# Altium schematic sheet Indicators.SchDoc
size 420 x 297 mm; SheetNumber: 4; SheetTotal: 6
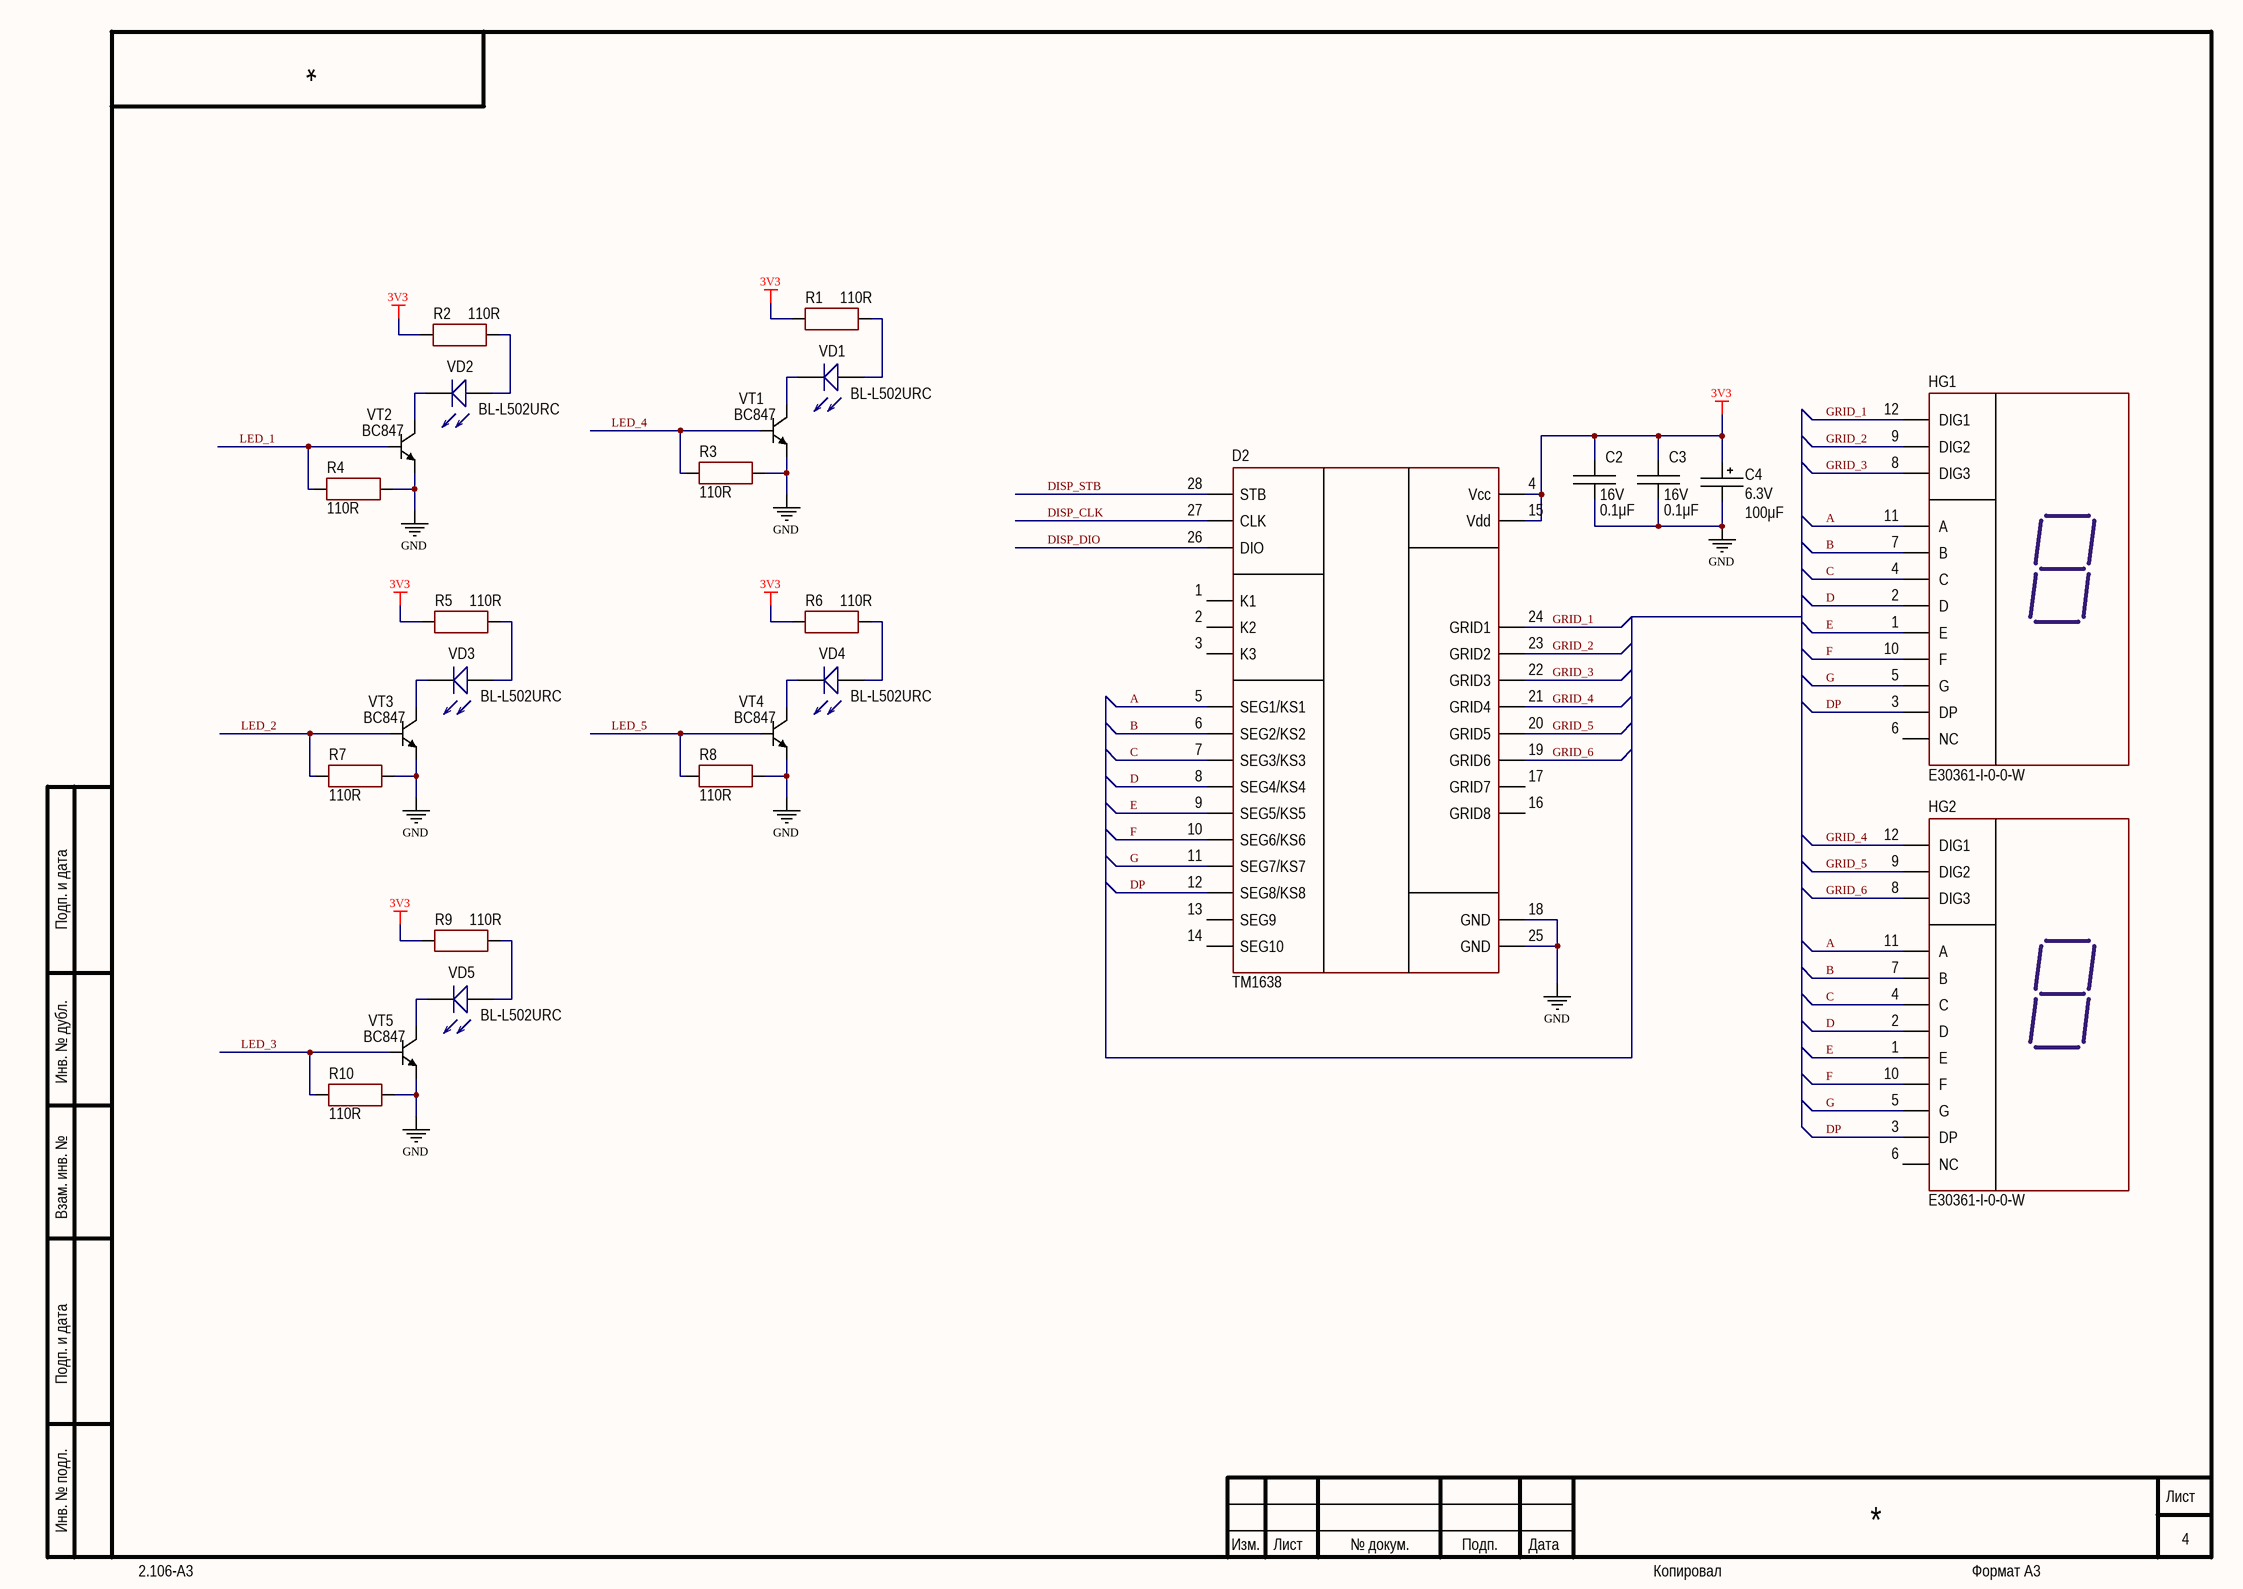
[diagram p0: Indicators.SchDoc]

## Parts
C2  value 0.1μF  Voltage: 16V  [CAP: 0805]
C3  value 0.1μF  Voltage: 16V  [CAP: 0805]
C4  value 100μF  Voltage: 6.3V  [CAP: TANTAL-C]
D2  (no value)  [28-SOP]
HG1  PartNumber: E30361-I-0-0-W  [DISP: CL3631BH - GREEN (0,36")]
HG2  PartNumber: E30361-I-0-0-W  [DISP: CL3631BH - GREEN (0,36")]
R1  value 110R  [RES: 1206]
R2  value 110R  [RES: 1206]
R3  value 110R  [RES: 1206]
R4  value 110R  [RES: 1206]
R5  value 110R  [RES: 1206]
R6  value 110R  [RES: 1206]
R7  value 110R  [RES: 1206]
R8  value 110R  [RES: 1206]
R9  value 110R  [RES: 1206]
R10  value 110R  [RES: 1206]
VD1  LED  [LED 5mm RED]  (value not drawn)
VD2  LED  [LED 5mm RED]  (value not drawn)
VD3  LED  [LED 5mm RED]  (value not drawn)
VD4  LED  [LED 5mm RED]  (value not drawn)
VD5  LED  [LED 5mm RED]  (value not drawn)
VT1  PartNumber: BC847  [SOT23]
VT2  PartNumber: BC847  [SOT23]
VT3  PartNumber: BC847  [SOT23]
VT4  PartNumber: BC847  [SOT23]
VT5  PartNumber: BC847  [SOT23]

## Nets
3V3: C2.2 C3.2 C4.1 D2.4(Vcc) D2.15(Vdd) R1.2 R2.2 R5.2 R6.2 R9.2
GND: C2.1 C3.1 C4.2 D2.18(GND) D2.25(GND) R3.1 R4.1 R7.1 R8.1 R10.1 VT1.2(E) VT2.2(E) VT3.2(E) VT4.2(E) VT5.2(E)
A: D2.5(SEG1/KS1) HG1.11(A) HG2.11(A)
B: D2.6(SEG2/KS2) HG1.7(B) HG2.7(B)
C: D2.7(SEG3/KS3) HG1.4(C) HG2.4(C)
D: D2.8(SEG4/KS4) HG1.2(D) HG2.2(D)
DISP_CLK: D2.27(CLK)
DISP_DIO: D2.26(DIO)
DISP_STB: D2.28(STB)
DP: D2.12(SEG8/KS8) HG1.3(DP) HG2.3(DP)
E: D2.9(SEG5/KS5) HG1.1(E) HG2.1(E)
F: D2.10(SEG6/KS6) HG1.10(F) HG2.10(F)
G: D2.11(SEG7/KS7) HG1.5(G) HG2.5(G)
GRID_1: D2.24(GRID1) HG1.12(DIG1)
GRID_2: D2.23(GRID2) HG1.9(DIG2)
GRID_3: D2.22(GRID3) HG1.8(DIG3)
GRID_4: D2.21(GRID4) HG2.12(DIG1)
GRID_5: D2.20(GRID5) HG2.9(DIG2)
GRID_6: D2.19(GRID6) HG2.8(DIG3)
LED_1: R4.2 VT2.1(B)
LED_2: R7.2 VT3.1(B)
LED_3: R10.2 VT5.1(B)
LED_4: R3.2 VT1.1(B)
LED_5: R8.2 VT4.1(B)
NetR1_1: R1.1 VD1.2
NetR2_1: R2.1 VD2.2
NetR5_1: R5.1 VD3.2
NetR6_1: R6.1 VD4.2
NetR9_1: R9.1 VD5.2
NetVD1_1: VD1.1 VT1.3(C)
NetVD2_1: VD2.1 VT2.3(C)
NetVD3_1: VD3.1 VT3.3(C)
NetVD4_1: VD4.1 VT4.3(C)
NetVD5_1: VD5.1 VT5.3(C)

Not connected (* = marked no-connect by the designer): D2 1(K1) 2(K2) 3(K3) 13(SEG9) 14(SEG10) 16(GRID8) 17(GRID7); HG1 6(NC); HG2 6(NC)

## Notes on the sheet
- Подп. и дата
- Инв. № дубл.
- Взам. инв. №
- Инв. № подл.
- Изм.
- Лист
- № докум.
- Подп.
- Дата
- 2.106-A3
- Копировал
- Формат А3

## Library data of the parts
C2 C3 = Ceramic_0805: Manufacturer: Yageo; PartNumber: CC0805KRX7R7BB104; ValueManufacturerPartNumber: Ceramic capacitor, 0.1μF, X7R, ±10%, 16V, 0805, -55...+125°C; TypeCapacitor: Ceramic capacitor; Tolerance: ±10%; TypeDielectric: X7R; Package: 0805; HelpURL: https://www.digikey.com/product-detail/en/yageo/CC0805KRX7R7BB104/311-1142-1-ND/303052; Temperature: -55...+125°C
C4 = Tantal_C: Manufacturer: AVX; PartNumber: F931E226MCC; ValueManufacturerPartNumber: Tantalum capacitor, 100μF, 6.3V, ±10%, 1.1Ohm, case C (6032), -55...+125°C; Impedance: 1.1Ohm; Tolerance: ±10%; TypeDielectric: X7R; TypeCapacitor: Tantalum capacitor; Package: case C (6032); HelpURL: https://www.digikey.com/product-detail/en/avx-corporation/F931E226MCC/478-8314-1-ND/4006045; Temperature: -55...+125°C
D2 = TM1638: 7-seg LED Driver; Manufacturer: TM(Shenzhen Titan Micro Elec); ValueManufacturerPartNumber: LED Display driver, 480 Mb/s, ULPI, USB, 3...3.6V, -40...+85°C, SOP-28; Supply: 3...3.6V; DataRate: 480 Mb/s; Protocol: ULPI, USB; HelpURL: https://www.lcsc.com/product-detail/span-style-background-color-ff0-LED-span-Display-Drivers_TM-Shenzhen-Titan-Micro-Elec-TM1638_C19187.html; Package: SOP-28; ComponentType: LED Display driver; Temperature: -40...+85°C; PartNumber: TM1638
HG1 HG2 = E30361: 7 segment LED indicator 3 dig; Package: 14х22,5; ComponentType: 7Seg LED; ValueManufacturerPartNumber: =ComponentType+', '+TypeStandart+', '+Core+', '+TypeInterface+', '+Temperature+', '+Package; Temperature: -40...+85°C
R1-R10 = Resistor_1206: Manufacturer: Yageo; PartNumber: RC1206JR-07100RL; ValueManufacturerPartNumber: Resistor film, 110R, ±5%, 1206, 0.25W, -55...+125°C; TypeResistor: Resistor film; Power: 0.25W; Tolerance: ±5%; Package: 1206; HelpURL: https://www.digikey.com/product-detail/en/yageo/RC1206JR-07100RL/311-100ERCT-ND/732153; Temperature: -55...+125°C
VD1-VD5 = LED: BL-L502URC; Value: LED; PartNumber: BL-L502URC
VT1-VT5 = BJT_NPN_132: Manufacturer: ON Semiconductor; ValueManufacturerPartNumber: NPN transistor, 45V, 100mA, 100MHz, 300mW, 0.6V, 420, SOT-23, -55...+125°C; TypeTransistor: NPN transistor; VoltageCE: 45V; CurrentCE: 100mA; VoltageSaturation: 0.6V; Frequency: 100MHz; CurrentGain: 420; MaxPower: 300mW; Package: SOT-23; HelpURL: https://www.digikey.com/product-detail/en/on-semiconductor/BC847CLT1G/BC847CLT1GOSCT-ND/917836; Temperature: -55...+125°C